# EAGLE design ClassDAmp (EAGLE 8.7.0)
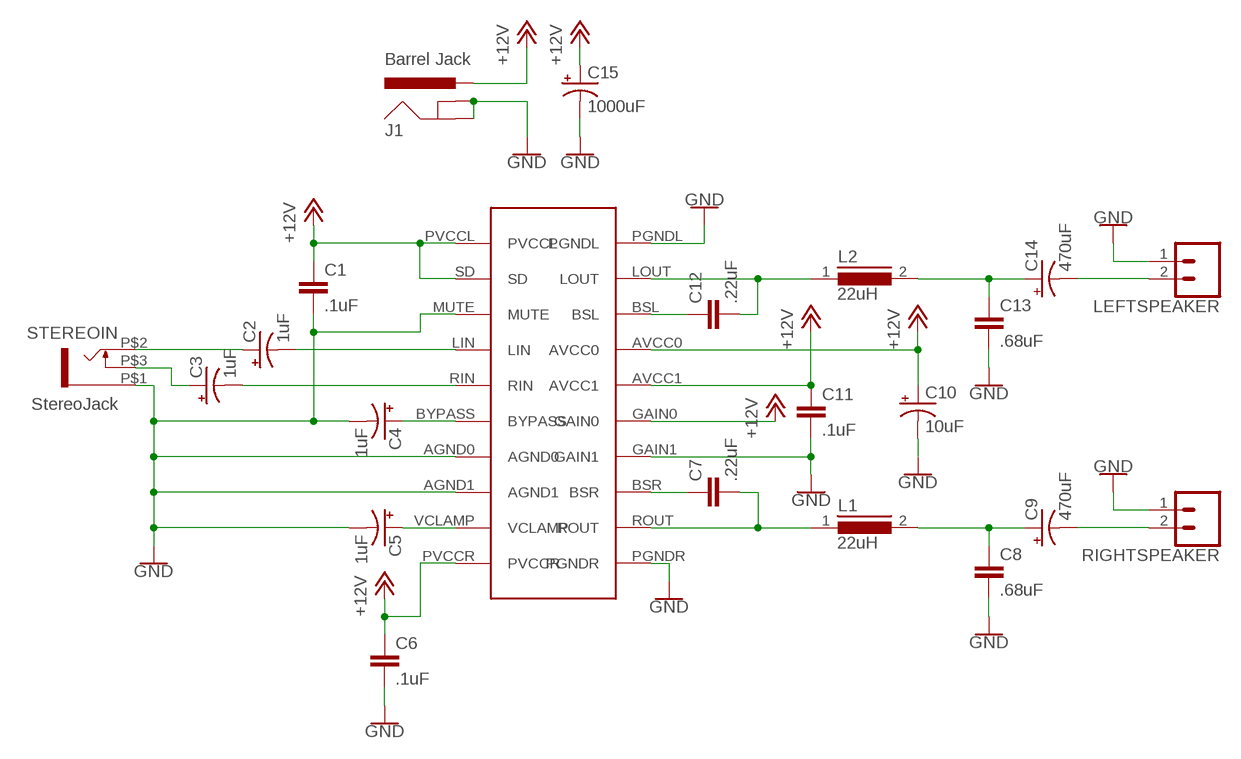
[diagram p0: schematic, sheet 1]

## Parts
C1  .1uF  0.33UF/330NF-0805-50V-10%  [0805]
C2  1uF  100UF-POLAR-RADIAL-2.5MM-25V-20%  [CPOL-RADIAL-2.5MM-6.5MM]
C3  1uF  100UF-POLAR-RADIAL-2.5MM-25V-20%  [CPOL-RADIAL-2.5MM-6.5MM]
C4  1uF  100UF-POLAR-RADIAL-2.5MM-25V-20%  [CPOL-RADIAL-2.5MM-6.5MM]
C5  1uF  100UF-POLAR-RADIAL-2.5MM-25V-20%  [CPOL-RADIAL-2.5MM-6.5MM]
C6  .1uF  0.33UF/330NF-0805-50V-10%  [0805]
C7  .22uF  0.33UF/330NF-0805-50V-10%  [0805]
C8  .68uF  0.33UF/330NF-0805-50V-10%  [0805]
C9  470uF  100UF-POLAR-RADIAL-2.5MM-25V-20%  [CPOL-RADIAL-2.5MM-6.5MM]
C10  10uF  100UF-POLAR-RADIAL-2.5MM-25V-20%  [CPOL-RADIAL-2.5MM-6.5MM]
C11  .1uF  0.33UF/330NF-0805-50V-10%  [0805]
C12  .22uF  0.33UF/330NF-0805-50V-10%  [0805]
C13  .68uF  0.33UF/330NF-0805-50V-10%  [0805]
C14  470uF  100UF-POLAR-RADIAL-2.5MM-25V-20%  [CPOL-RADIAL-2.5MM-6.5MM]
C15  1000uF  100UF-POLAR-RADIAL-2.5MM-25V-20%  [CPOL-RADIAL-2.5MM-6.5MM]
J1  Barrel Jack  POWER_JACKPTH_BREAD  [POWER_JACK_PTH_BREAD]
L1  22uH  82114R  [82114R]
L2  22uH  82114R  [82114R]
LEFTSPEAKER  CONN_023.5MM  [SCREWTERMINAL-3.5MM-2]
RIGHTSPEAKER  CONN_023.5MM  [SCREWTERMINAL-3.5MM-2]
STEREOIN  StereoJack  HORIZONTAL_STERO_JACK  [HORIZONTAL_STEREO_JACK]
U$1  TPA3122  [TPA3122]

## Nets
+12V: C1.1 C6.1 C10.1(+) C11.1 C15.1(+) J1.PWR U$1.AVCC0 U$1.AVCC1 U$1.GAIN0 U$1.PVCCL U$1.PVCCR U$1.SD
GND: C1.2 C4.2(-) C5.2(-) C6.2 C8.2 C10.2(-) C11.2 C13.2 C15.2(-) J1.GND J1.GNDBREAK LEFTSPEAKER.1 RIGHTSPEAKER.1 STEREOIN.P$1 U$1.AGND0 U$1.AGND1 U$1.GAIN1 U$1.MUTE U$1.PGNDL U$1.PGNDR
N$1: C2.1(+) STEREOIN.P$2
N$2: C3.1(+) STEREOIN.P$3
N$3: C2.2(-) U$1.LIN
N$4: C3.2(-) U$1.RIN
N$5: C4.1(+) U$1.BYPASS
N$6: C7.1 U$1.BSR
N$7: C5.1(+) U$1.VCLAMP
N$8: C7.2 L1.1 U$1.ROUT
N$9: C14.2(-) LEFTSPEAKER.2
N$10: C8.1 C9.1(+) L1.2
N$11: C9.2(-) RIGHTSPEAKER.2
N$14: C12.1 U$1.BSL
N$15: C12.2 L2.1 U$1.LOUT
N$16: C13.1 C14.1(+) L2.2

## Library data of the parts
C1 C6-C8 C11-C13 = SparkFun-Capacitors:0.33UF/330NF: 0.33µF/330nF ceramic capacitors A capacitor is a passive two-terminal electrical component used to store electrical energy temporarily in an electric field.; PROD_ID: CAP-08469; VALUE: 0.33µF
C2-C5 C9 C10 C14 C15 = SparkFun-Capacitors:100UF-POLAR: 100µF polarized capacitors A capacitor is a passive two-terminal electrical component used to store electrical energy temporarily in an electric field.; PROD_ID: CAP-08439; VALUE: 100uF
J1 = SparkFun-Connectors:POWER_JACK: Power Jack Connector This is the standard 5.5mm barrel jack for power. The PTH is the most common, proven, reliable, footprint. The Slot footprint only works if the mill layer is transmitted to the PCB fab house so be warned. Here are the connectors we sell at SparkFun: DC Barrel Power Jack/Connector <https://www.sparkfun.com/products/119> (PRT-00119) DC Barrel Power Jack/Connector (SMD) <https://www.sparkfun.com/products/12748> (PRT-12748) DC Barrel Jack Adapter - Breadboard Compatible <https://www.sparkfun.com/products/10811> (PRT-10811) It is used on this SparkFun product (and many, many others): SparkFun RedBoard - Programmed with Arduino <https://www.sparkfun.com/products/12757> (DEV-12757) Also, if you need a mating power supply or connector, please check these out: Wall Adapter Power Supply - 9VDC 650mA <https://www.sparkfun.com/products/298> (TOL-00298) DC Barrel Jack Adapter - Male <https://www.sparkfun.com/products/10287> (PRT-10287); PROD_ID: PRT-10811
L1 L2 = inductors:82114R: INDUCTOR; SPICEPREFIX: L
LEFTSPEAKER RIGHTSPEAKER = SparkFun-Connectors:CONN_02: Multi connection point. Often used as Generic Header-pin footprint for 0.1 inch spaced/style header connections On any of the 0.1 inch spaced packages, you can populate with these: Break Away Headers - Straight <https://www.sparkfun.com/products/116> (PRT-00116) Break Away Male Headers - Right Angle <https://www.sparkfun.com/products/553> (PRT-00553) Female Headers <https://www.sparkfun.com/products/115> (PRT-00115) Break Away Headers - Machine Pin <https://www.sparkfun.com/products/117> (PRT-00117) Break Away Female Headers - Swiss Machine Pin <https://www.sparkfun.com/products/743> (PRT-00743) For SCREWTERMINALS and SPRING TERMINALS visit here: Screw Terimnals on SparkFun.com <https://www.sparkfun.com/search/results?term=Screw+Terminals> (5mm/3.5mm/2.54mm spacing) This device is also useful as a general connection point to wire up your design to another part of your project. Our various solder wires solder well into these plated through hole pads. Hook-Up Wire - Assortment (Stranded, 22 AWG) <https://www.sparkfun.com/products/11375> (PRT-11375) Hook-Up Wire - Assortment (Solid Core, 22 AWG) <https://www.sparkfun.com/products/11367> (PRT-11367) View the entire wire category on our website here <https://www.sparkfun.com/categories/141> Special notes: Molex polarized connector foot print use with: PRT-08233 with associated crimp pins and housings. 2.54_SCREWTERM for use with PRT-10571. 3.5mm Screw Terminal footprints for PRT-08084 5mm Screw Terminal footprints for use with PRT-08432; PROD_ID: CONN-08399
STEREOIN = thonkiconn:HORIZONTAL_STERO_JACK
U$1 = adafruit:TPA3122

## Board
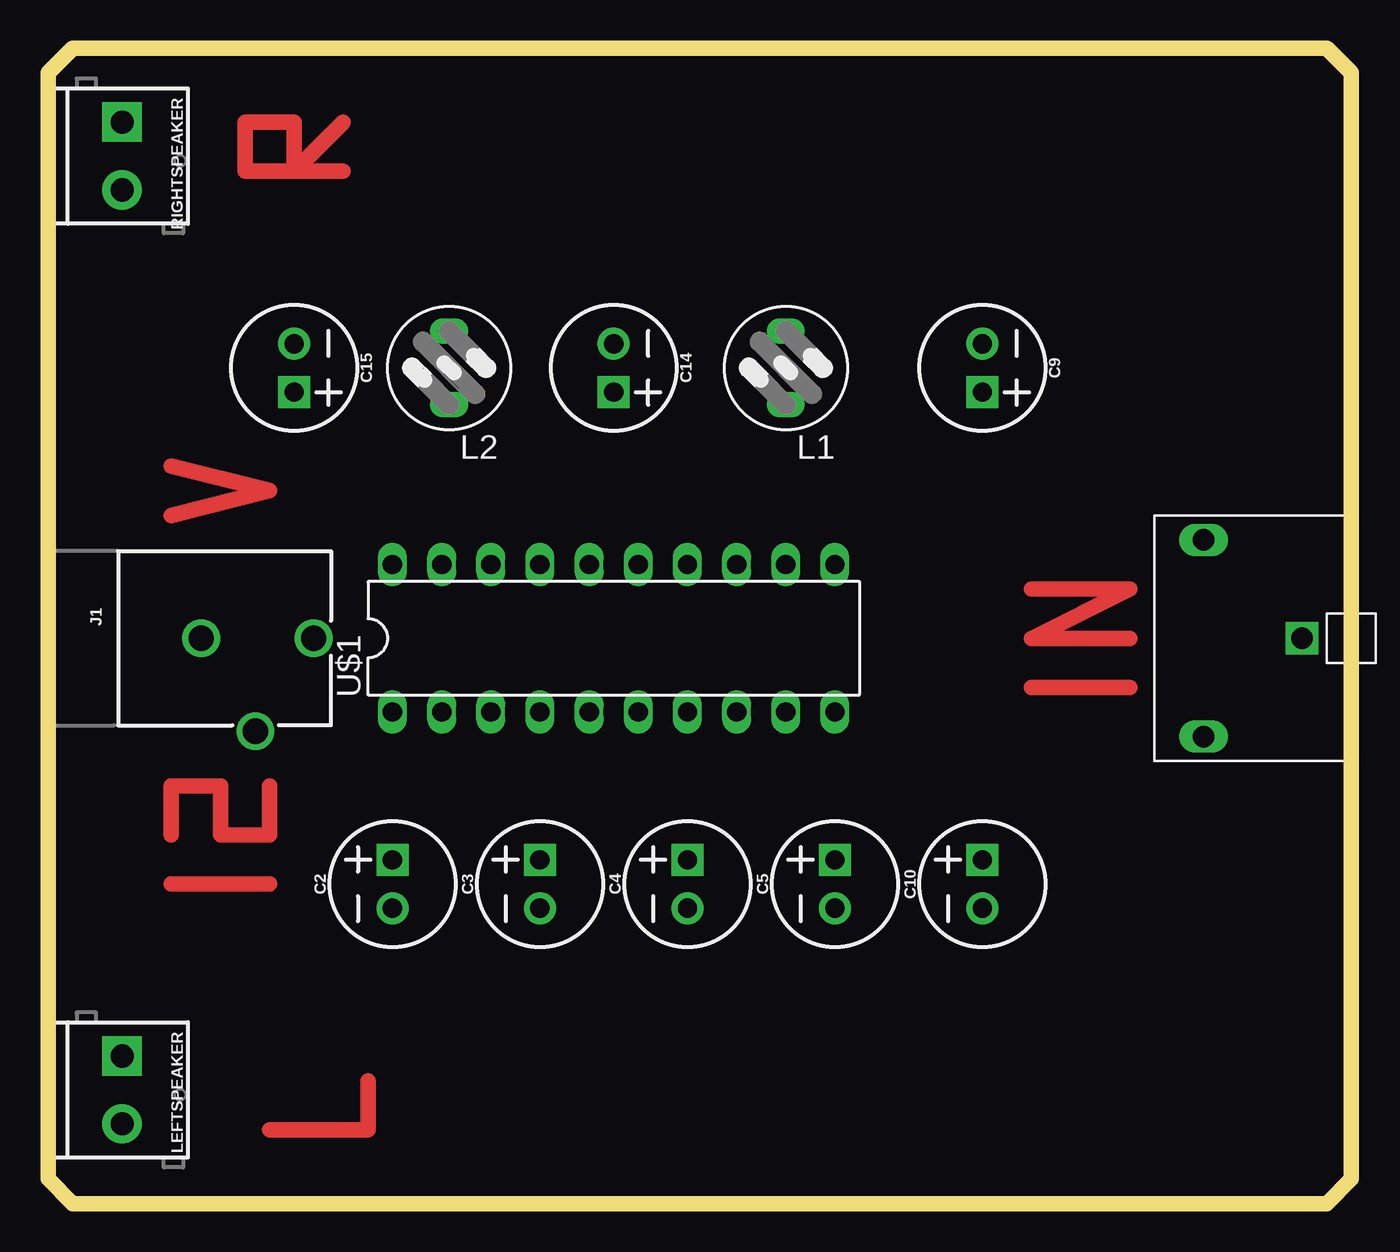
[diagram p1: board, top side]
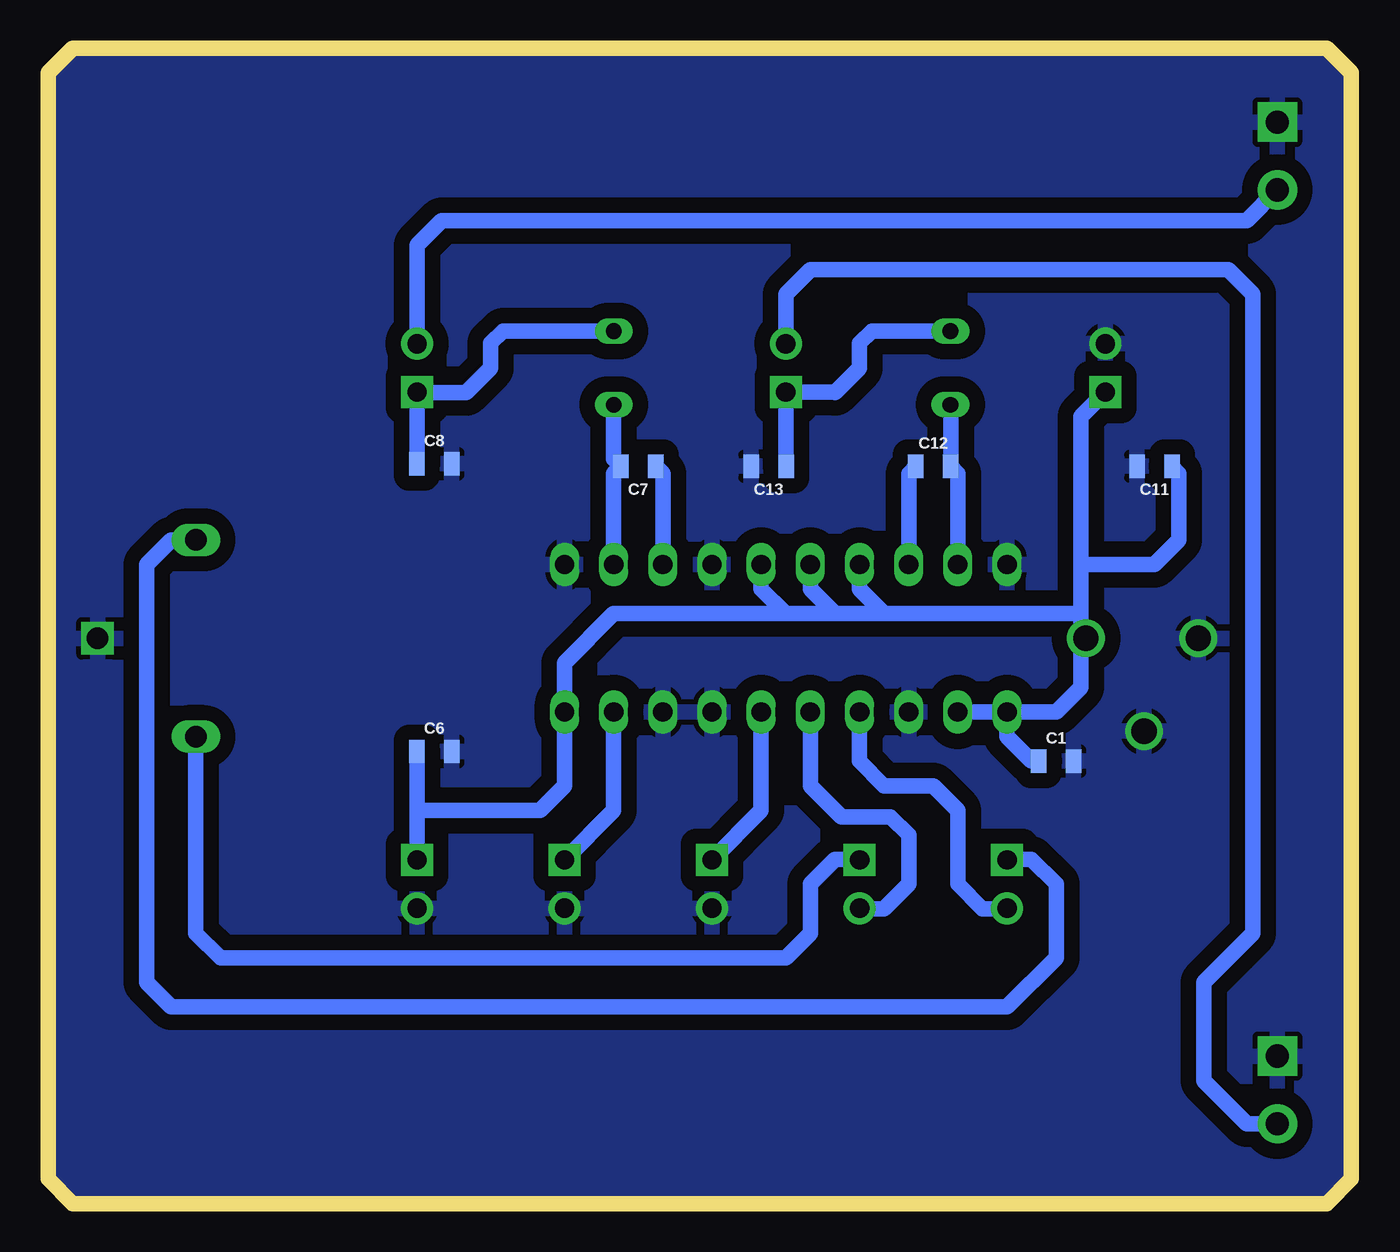
[diagram p2: board, bottom side, seen from below]

Size 67.31 x 59.69 mm. Coordinates in mm from the lower left corner, seen from the top.
Outline: 66.04,0 1.27,0 0,1.27 0,58.42 1.27,59.69 66.04,59.69 67.31,58.42 67.31,1.27 66.04,0
Copper layers (1*16): Top 0.035mm / dielectric 1.5mm / Bottom 0.035mm
Design rules "OthermillDRC_1_32_v2": minimum track width 8mil, minimum drill 0.8mm, track to track 0.794003125mm, track to pad 0.794003125mm, pad to pad 0.794003125mm, via to via 0.794003125mm, smd to smd 0mil, copper to edge 0mil, drill to drill 1mil, minimum pad ring 10mil, minimum via ring 10mil, stop-mask expansion 1mil, vias tented up to drill 30mil, thermal gap 10mil

### Footprints (pad centres in the part's own frame; a part is rotated, then mirrored left to right if it is on the bottom)
0805 = smd 0.8 x 1.2: 1 -0.9,0; 2 0.9,0
CPOL-RADIAL-2.5MM-6.5MM = drill 1 pad 1.651 square: 1 1.25,0 | drill 1 pad 1.651: 2 -1.25,0
POWER_JACK_PTH_BREAD = drill 1.3: GND 0,7.9; GNDBREAK 4.8,10.7; PWR 0,13.7
82114R = drill 0.813 long: 1 0,1.905; 2 0,-1.905
SCREWTERMINAL-3.5MM-2 = drill 1.2 pad 2.032 square: 1 0,0 | drill 1.2 pad 2.032: 2 3.5,0
HORIZONTAL_STEREO_JACK = drill 1.118 square: P$1 3.81,5.08 | drill 1.118 long: P$2 -1.27,10.16; P$3 -1.27,0
TPA3122 = drill 1 long: AGND0 5.08,-3.81; AGND1 7.62,-3.81; AVCC0 -2.54,3.81; AVCC1 0,3.81; BSL -5.08,3.81; BSR 7.62,3.81; BYPASS 2.54,-3.81; GAIN0 2.54,3.81; GAIN1 5.08,3.81; LIN -2.54,-3.81; LOUT -7.62,3.81; MUTE -5.08,-3.81; PGNDL -10.16,3.81; PGNDR 12.7,3.81; PVCCL -10.16,-3.81; PVCCR 12.7,-3.81; RIN 0,-3.81; ROUT 10.16,3.81; SD -7.62,-3.81; VCLAMP 10.16,-3.81

### Placement (x,y rotation side)
C1  15.24,22.86 0 bottom
C2  17.78,16.51 90 top
C3  25.4,16.51 90 top
C4  33.02,16.51 90 top
C5  40.64,16.51 90 top
C6  47.37,23.37 0 bottom
C7  36.83,38.1 180 bottom
C8  47.37,38.23 0 bottom
C9  48.26,43.18 270 top
C10  48.26,16.51 90 top
C11  10.16,38.1 180 bottom
C12  21.59,38.1 0 bottom
C13  30.1,38.1 180 bottom
C14  29.21,43.18 270 top
C15  12.7,43.18 270 top
J1  0,29.21 270 top
L1  38.1,43.18 180 top
L2  20.7,43.18 180 top
LEFTSPEAKER  3.81,7.62 270 top
RIGHTSPEAKER  3.81,55.88 270 top
STEREOIN  60.96,24.13 0 top
U$1  27.94,29.21 0 top

### Tracks (layer width: path | path; a pad name or v marks a point on that pad's centre or on a via)
+12V
  Bottom 0.813: U$1.SD U$1.PVCCL | 13.97,30.48 24.13,30.48 | 24.13,30.48 26.67,30.48 | 26.67,30.48 29.21,30.48 | 29.21,30.48 38.1,30.48 40.64,27.94 U$1.PVCCR 40.64,21.59 41.91,20.32 48.26,20.32 | 13.97,30.48 13.97,29.48 J1.PWR 13.97,28.94 13.97,26.67 15.24,25.4 U$1.PVCCL | 13.97,30.48 13.97,33.02 | 13.97,33.02 10.16,33.02 8.89,34.29 8.89,37.73 C11.1 | 24.13,30.48 25.4,31.75 U$1.AVCC0 | 26.67,30.48 27.94,31.75 U$1.AVCC1 | C10.1 48.26,20.32 | C1.1 16.51,22.86 17.78,24.13 U$1.PVCCL | U$1.GAIN0 30.48,31.75 29.21,30.48 | 48.26,20.32 48.27,20.33 C6.1 | C15.1 13.97,40.66 13.97,33.02
GND
  pour Bottom: 1.27,59.69 66.04,59.69 67.31,58.42 67.31,1.27 66.04,0 1.27,0 0,1.27 0,58.42
N$1
  Bottom 0.813: C2.1 17.76,17.78 16.51,17.78 15.24,16.51 15.24,12.7 17.78,10.16 60.96,10.16 62.23,11.43 62.23,33.02 60.96,34.29 STEREOIN.P$2
N$2
  Bottom 0.813: STEREOIN.P$3 59.69,13.97 58.42,12.7 29.21,12.7 27.94,13.97 27.94,16.51 26.67,17.78 25.42,17.78 C3.1
N$3
  Bottom 0.813: C2.2 17.8,15.24 19.05,15.24 20.32,16.51 20.32,20.32 21.59,21.59 24.13,21.59 25.4,22.86 U$1.LIN
N$4
  Bottom 0.813: C3.2 25.38,15.24 24.13,15.24 22.86,16.51 22.86,19.05 23.79,19.98 26.33,19.98 27.94,21.59 U$1.RIN
N$5
  Bottom 0.813: C4.1 31.75,19.03 31.75,19.05 30.48,20.32 U$1.BYPASS
N$6
  Bottom 0.813: U$1.BSR 35.56,37.73 C7.1
N$7
  Bottom 0.813: C5.1 39.37,19.03 39.37,19.05 38.1,20.32 U$1.VCLAMP
N$8
  Bottom 0.813: U$1.ROUT 38.1,37.73 C7.2 38.1,38.47 L1.1
N$9
  Bottom 0.813: LEFTSPEAKER.2 5.39,4.12 7.62,6.35 7.62,11.43 5.08,13.97 5.08,46.99 6.35,48.26 27.94,48.26 29.21,46.99 C14.2
N$10
  Bottom 0.813: C8.1 48.25,41.92 | 48.25,41.92 C9.1 | L1.2 43.81,45.09 44.45,44.45 44.45,43.18 45.72,41.91 48.24,41.91 48.25,41.92
N$11
  Bottom 0.813: RIGHTSPEAKER.2 5.39,50.8 46.99,50.8 48.26,49.53 C9.2
N$12
  Top 0.813: 11.43,3.81 16.51,3.81 16.51,6.35
N$13
  Top 0.813: 12.7,53.34 10.16,53.34 10.16,55.88 12.7,55.88 12.7,53.34 | 12.7,53.34 15.24,53.34 | 12.7,53.34 15.24,55.88
N$14
  Bottom 0.813: C12.1 22.86,37.73 U$1.BSL
N$15
  Bottom 0.813: U$1.LOUT 20.32,37.73 C12.2 20.69,41.26 L2.1
N$16
  Bottom 0.813: C13.1 C14.1 26.69,41.93 26.67,41.91 25.4,43.18 25.4,44.45 24.77,45.09 L2.2
N$18
  Top 0.813: 50.8,26.67 55.88,26.67
N$19
  Top 0.813: 55.88,29.21 50.8,29.21 55.88,31.75 50.8,31.75
N$20
  Top 0.813: 6.35,16.51 11.43,16.51
N$21
  Top 0.813: 6.35,19.05 6.35,21.59 8.89,21.59 8.89,19.05 11.43,19.05 11.43,21.59
N$22
  Top 0.813: 6.35,35.56 11.43,36.83 6.35,38.1